# EAGLE schematic Arduino_MEGA2560_shield (EAGLE 7.5.0)
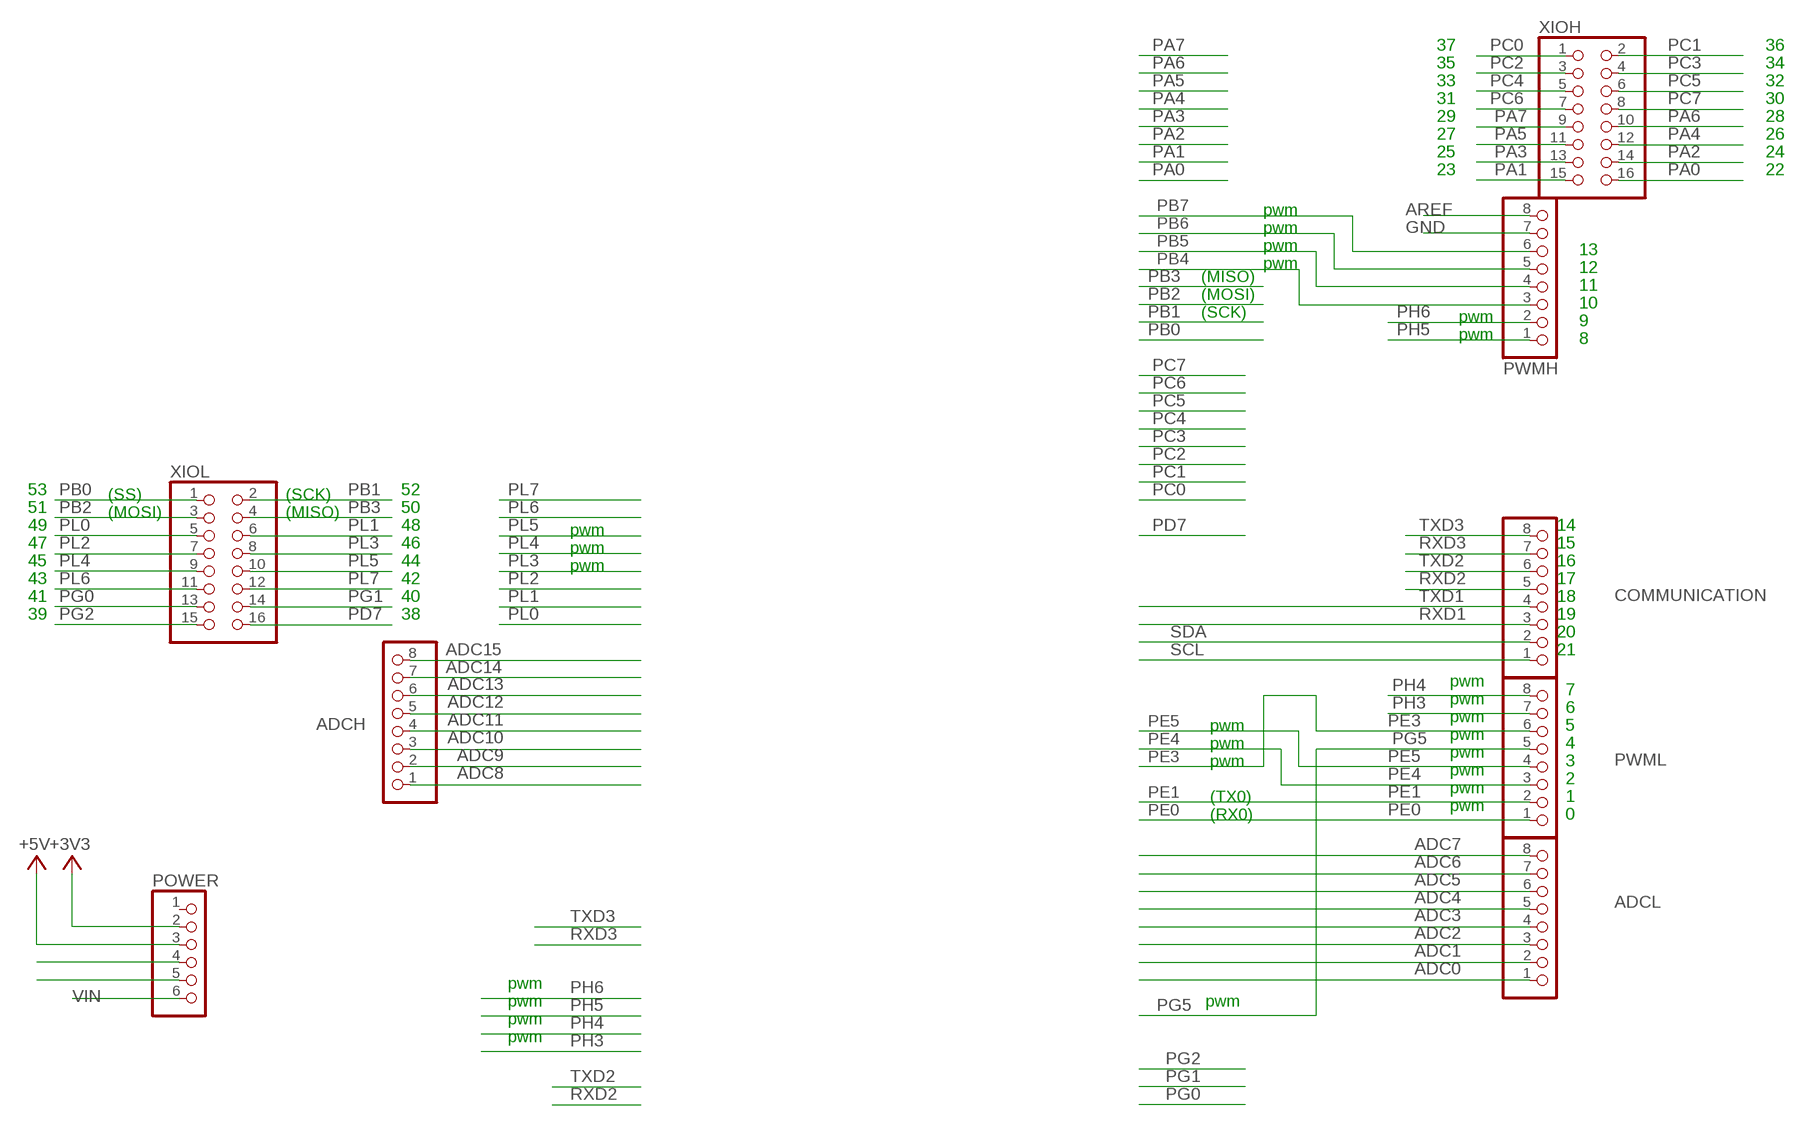
[diagram p0: schematic, sheet 1]

## Parts
ADCH  PINHD-1X8  [1X08]
ADCL  PINHD-1X8  [1X08]
COMMUNICATION  PINHD-1X8  [1X08]
POWER  PINHD-1X6  [1X06]
PWMH  PINHD-1X8  [1X08]
PWML  PINHD-1X8  [1X08]
XIOH  PINHD-2X8  [2X08]
XIOL  PINHD-2X8  [2X08]

## Nets
+3V3: POWER.2
+5V: POWER.3
ADC0: ADCL.1
ADC1: ADCL.2
ADC2: ADCL.3
ADC3: ADCL.4
ADC4: ADCL.5
ADC5: ADCL.6
ADC6: ADCL.7
ADC7: ADCL.8
ADC8: ADCH.1
ADC9: ADCH.2
ADC10: ADCH.3
ADC11: ADCH.4
ADC12: ADCH.5
ADC13: ADCH.6
ADC14: ADCH.7
ADC15: ADCH.8
AREF: PWMH.8
GND: PWMH.7
N$1: POWER.5
N$2: POWER.4
PA0: XIOH.16
PA1: XIOH.15
PA2: XIOH.14
PA3: XIOH.13
PA4: XIOH.12
PA5: XIOH.11
PA6: XIOH.10
PA7: XIOH.9
PB0: XIOL.1
PB1: XIOL.2
PB2: XIOL.3
PB3: XIOL.4
PB4: PWMH.3
PB5: PWMH.4
PB6: PWMH.5
PB7: PWMH.6
PC0: XIOH.1
PC1: XIOH.2
PC2: XIOH.3
PC3: XIOH.4
PC4: XIOH.5
PC5: XIOH.6
PC6: XIOH.7
PC7: XIOH.8
PD7: XIOL.16
PE0: PWML.1
PE1: PWML.2
PE3: PWML.6
PE4: PWML.3
PE5: PWML.4
PG0: XIOL.13
PG1: XIOL.14
PG2: XIOL.15
PG5: PWML.5
PH3: PWML.7
PH4: PWML.8
PH5: PWMH.1
PH6: PWMH.2
PL0: XIOL.5
PL1: XIOL.6
PL2: XIOL.7
PL3: XIOL.8
PL4: XIOL.9
PL5: XIOL.10
PL6: XIOL.11
PL7: XIOL.12
RXD1: COMMUNICATION.3
RXD2: COMMUNICATION.5
RXD3: COMMUNICATION.7
SCL: COMMUNICATION.1
SDA: COMMUNICATION.2
TXD1: COMMUNICATION.4
TXD2: COMMUNICATION.6
TXD3: COMMUNICATION.8
VIN: POWER.6
Unconnected: POWER.1

## Notes on the sheet
- 37 | 36
- 35 | 34
- 33 | 32
- 31 | 30
- 29 | 28
- 27 | 26
- 25 | 24
- 23 | 22
- pwm
- pwm
- pwm | 13
- pwm | 12
- (MISO)
- 11
- (MOSI)
- 10
- (SCK) | pwm
- 9
- pwm | 8
- 53 | (SS) | (SCK) | 52
- 51 | (MOSI) | (MISO) | 50
- 49 | 48 | pwm | 14
- 47 | 46 | pwm | 15
- 45 | 44 | pwm | 16
- 43 | 42 | 17
- 41 | 40 | 18
- 39 | 38 | 19
- 20
- 21
- pwm
- 7
- pwm
- 6
- pwm
- pwm | 5
- pwm
- pwm | 4
- pwm
- pwm | 3
- pwm
- 2
- pwm
- (TX0) | 1
- pwm
- (RX0) | 0
- pwm
- pwm | pwm
- pwm
- pwm

## Library data of the parts
ADCH ADCL COMMUNICATION PWMH PWML = pinhead:PINHD-1X8: PIN HEADER
POWER = pinhead:PINHD-1X6: PIN HEADER
XIOH XIOL = pinhead:PINHD-2X8: PIN HEADER

## Net classes
0 default: width 0.152 mm, drill 0.305 mm, clearance 0.152 mm